# EAGLE design BPW34 (EAGLE 6.4)
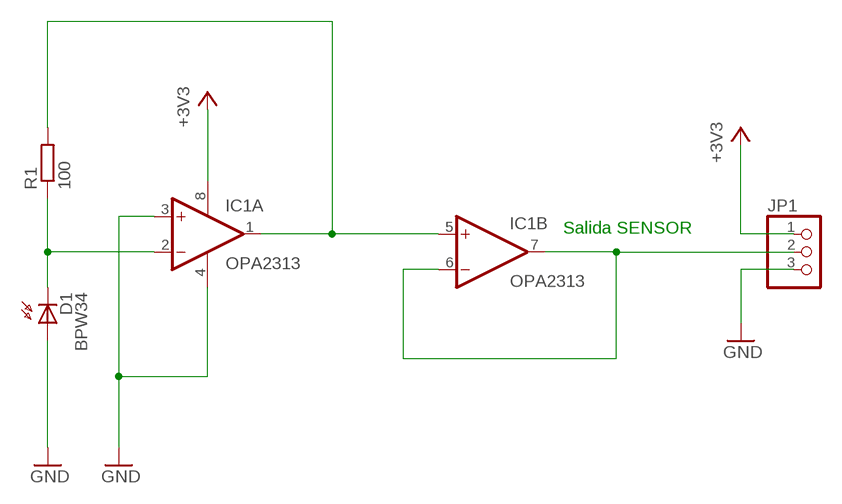
[diagram p0: schematic, sheet 1]

## Parts
D1  BPW34  BPW32  [BPW32]
IC1  OPA2313  TL082D  [SO08]
JP1  PINHD-1X3  [1X03]
R1  100  R-EU_0207/10  [0207/10]

## Nets
+3V3: IC1.8(P:V+) JP1.1
GND: D1.A IC1.3(A:+IN) IC1.4(P:V-) JP1.3
N$1: IC1.1(A:OUT) IC1.5(B:+IN) R1.2
N$3: IC1.6(B:-IN) IC1.7(B:OUT) JP1.2
N$4: D1.K(C) IC1.2(A:-IN) R1.1

## Notes on the sheet
- Salida SENSOR

## Library data of the parts
D1 = opto-trans-siemens:BPW32: PHOTO DIODE
IC1 = linear:TL082: OP AMP
JP1 = pinhead:PINHD-1X3: PIN HEADER
R1 = rcl:R-EU_: RESISTOR, European symbol

## Board
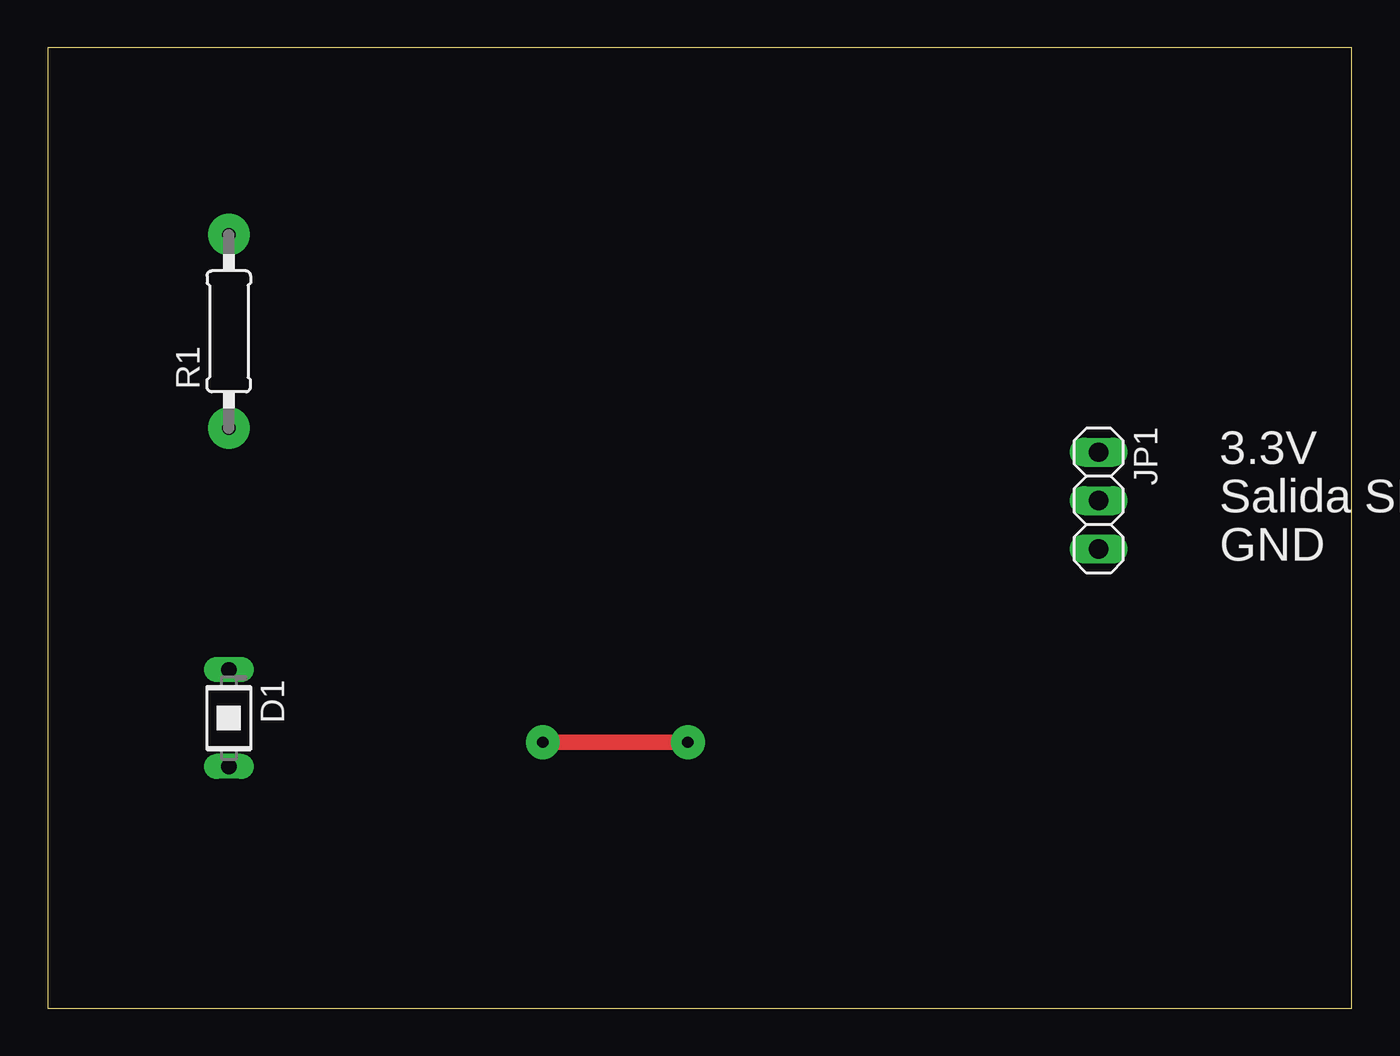
[diagram p1: board, top side]
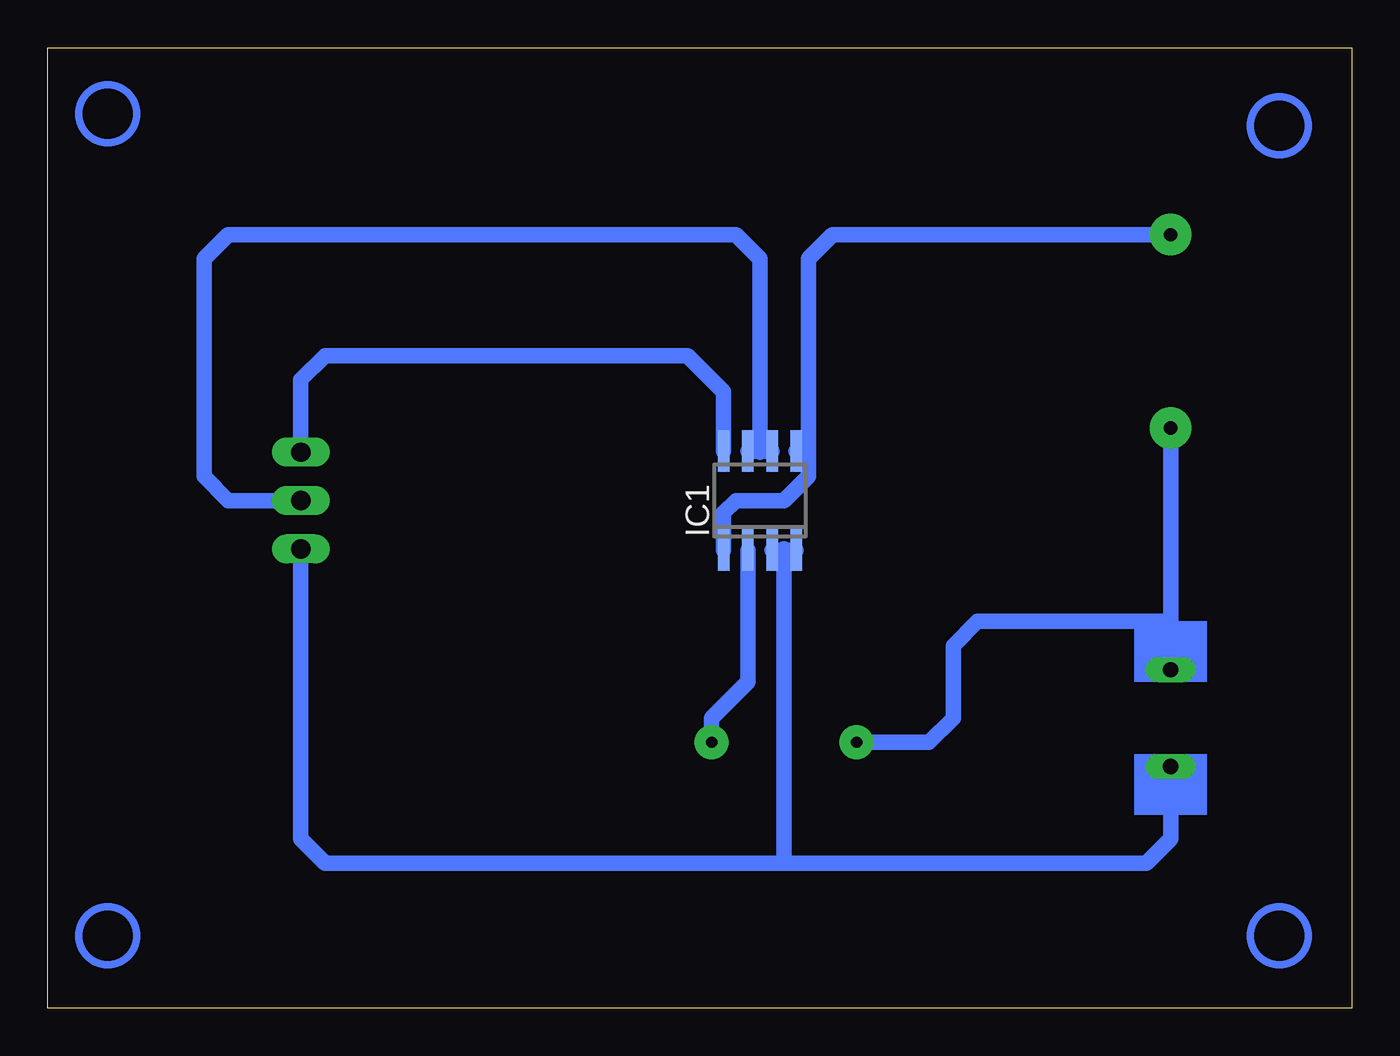
[diagram p2: board, bottom side, seen from below]

Size 68.56 x 50.47 mm. Coordinates in mm from the lower left corner, seen from the top.
Outline: 0,0 68.56,0 68.56,50.47 0,50.47 0,0
Copper layers (1*16): Top 0.035mm / dielectric 1.5mm / Bottom 0.035mm
Design rules "default": minimum track width 10mil, minimum drill 24mil, track to track 8mil, track to pad 8mil, pad to pad 8mil, via to via 8mil, smd to smd 8mil, copper to edge 40mil, drill to drill 8mil, minimum pad ring 10mil, minimum via ring 8mil, stop-mask expansion 4mil, vias tented up to drill 0mil, thermal gap 10mil

### Footprints (pad centres in the part's own frame; a part is rotated, then mirrored left to right if it is on the bottom)
BPW32 = drill 0.813 long: A 0,2.54; K 0,-2.54
SO08 = smd 0.6 x 2.2: 1 -1.905,-2.6; 2 -0.635,-2.6; 3 0.635,-2.6; 4 1.905,-2.6; 5 1.905,2.6; 6 0.635,2.6; 7 -0.635,2.6; 8 -1.905,2.6
1X03 = drill 1.016 long: 1 -2.54,0; 2 0,0; 3 2.54,0
0207/10 = drill 0.7 pad 2.184: 1 -5.08,0; 2 5.08,0

### Placement (x,y rotation side)
D1  9.53,15.24 180 top
IC1  31.11,26.67 0 bottom
JP1  55.24,26.67 270 top
R1  9.53,35.56 90 top

### Tracks (layer width: path | path; a pad name or v marks a point on that pad's centre or on a via)
+3V3
  Bottom 0.813: IC1.8 33.02,32.39 34.92,34.29 53.97,34.29 55.24,33.02 JP1.1
GND
  Bottom 0.813: JP1.3 55.24,8.89 53.97,7.62 29.84,7.62 | 29.84,7.62 10.79,7.62 9.53,8.89 D1.A | IC1.3 IC1.4 29.78,24.07 29.84,24.13 29.84,7.62
N$1
  Bottom 0.813: R1.2 27.3,40.64 28.57,39.37 28.57,30.48 28.57,29.91 | 28.57,29.91 IC1.5 | IC1.1 33.02,26.03 32.38,26.67 29.84,26.67 28.57,27.94 28.57,29.91
N$3
  Bottom 0.813: IC1.7 IC1.6 31.05,29.27 31.11,29.21 31.11,39.37 32.38,40.64 59.05,40.64 60.32,39.37 60.32,27.94 59.05,26.67 JP1.2
N$4  (via drill 0.6 pad 1.78)
  Top 0.813: v26.03,13.97 v33.65,13.97
  Bottom 0.813: 9.53,20.32 R1.1 | D1.K 9.53,20.32 | 9.53,20.32 19.69,20.32 20.95,19.05 20.95,15.24 22.23,13.97 v26.03,13.97 | v33.65,13.97 33.65,15.24 31.75,17.15 IC1.2
(copper drawn outside any net)
  shapes: Bottom area x2, Bottom circle x4

### Text on the board
tPlace: 3.3V | Salida SENSOR | GND